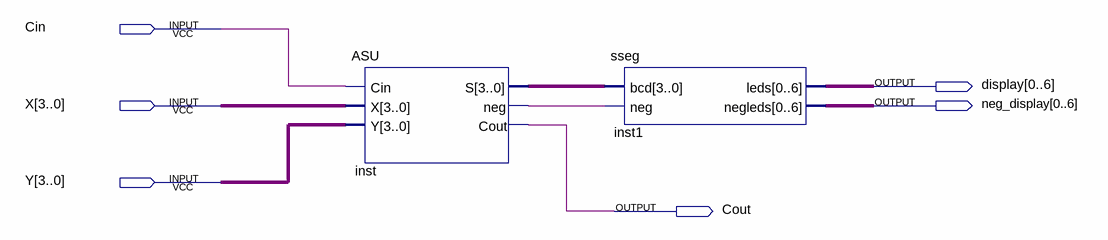
[diagram p0: schematic sheet]
// Quartus schematic CombinedASU1.bdf as structural Verilog: 2 symbols, 6 pins
module CombinedASU1 (
  input  Cin,
  input  [3:0] X,
  input  [3:0] Y,
  output [0:6] display,
  output [0:6] neg_display,
  output Cout
);

  wire inst_neg;
  wire [3:0] inst_s;

  ASU inst (.Cin(Cin), .X(X), .Y(Y), .S(inst_s), .neg(inst_neg), .Cout(Cout));
  sseg inst1 (.bcd(inst_s), .neg(inst_neg), .leds(display), .negleds(neg_display));
endmodule
